# Altium project DDR5_Nucleo_Shield.PrjPcb
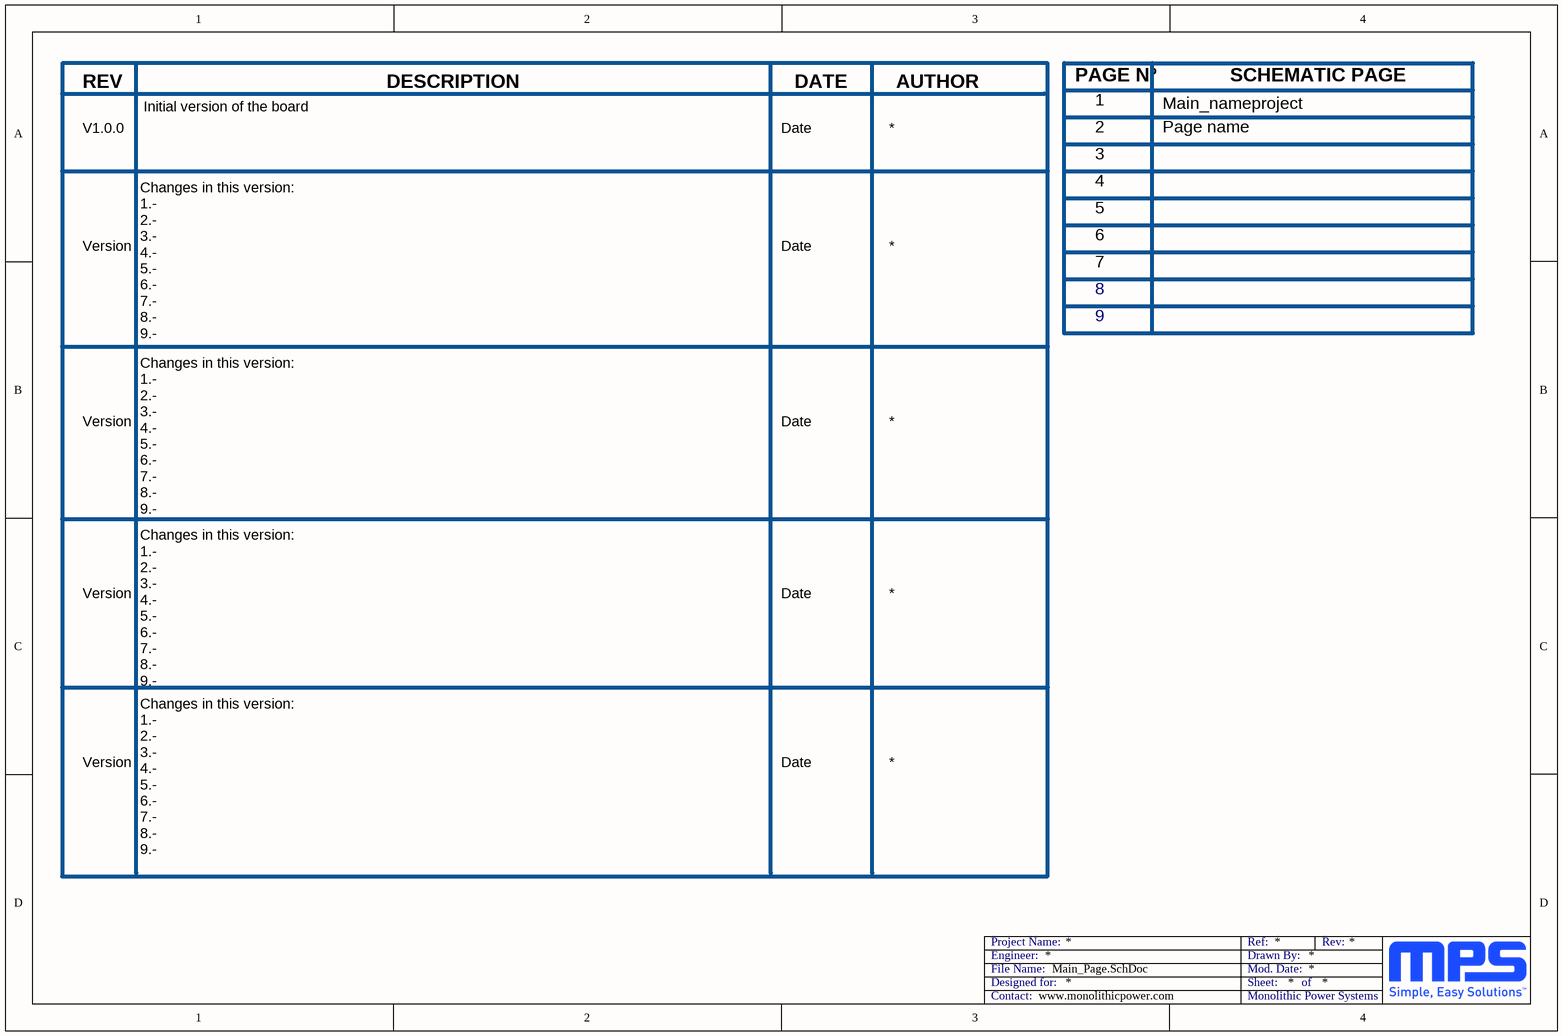
[diagram p0: Main_Page.SchDoc]
7 sheets, 129 parts. Net scope: global (net labels, ports and power ports of the same name join across sheets).
Board file: DDR5_Nucleo_Shield_PCB.PcbDoc
Sheets:
  Main_Page.SchDoc
  Power_Supply.SchDoc
  I3C_and_I2C_Slaves.SchDoc
  Peripherals.SchDoc
  Keyboard_Buttons.SchDoc
  Nucleo_Connector.SchDoc
  DDR5_System_Connector.SchDoc

## Sheet Main_Page.SchDoc
size A4; MPS_Contact: www.monolithicpower.com

### Notes on the sheet
- REV
- DESCRIPTION
- DATE
- AUTHOR
- PAGE Nº
- 1
- Main_nameproject
- SCHEMATIC PAGE
- V1.0.0
- Initial version of the board
- Date
- 2
- 3
- Page name
- 4
- 5
- 6
- Version
- 7
- 8
- Changes in this version:
  1.-
  2.-
  3.-
  4.-
  5.-
  6.-
  7.-
  8.-
  9.-
- 9
- Engineer:
- Designed for:
- File Name:
- Project Name:
- Mod. Date:
- Sheet:
- Drawn By:
- Ref:
- of
- Rev:
- Contact:
- Monolithic Power Systems

## Sheet Power_Supply.SchDoc
size A4; MPS_Contact: www.monolithicpower.com
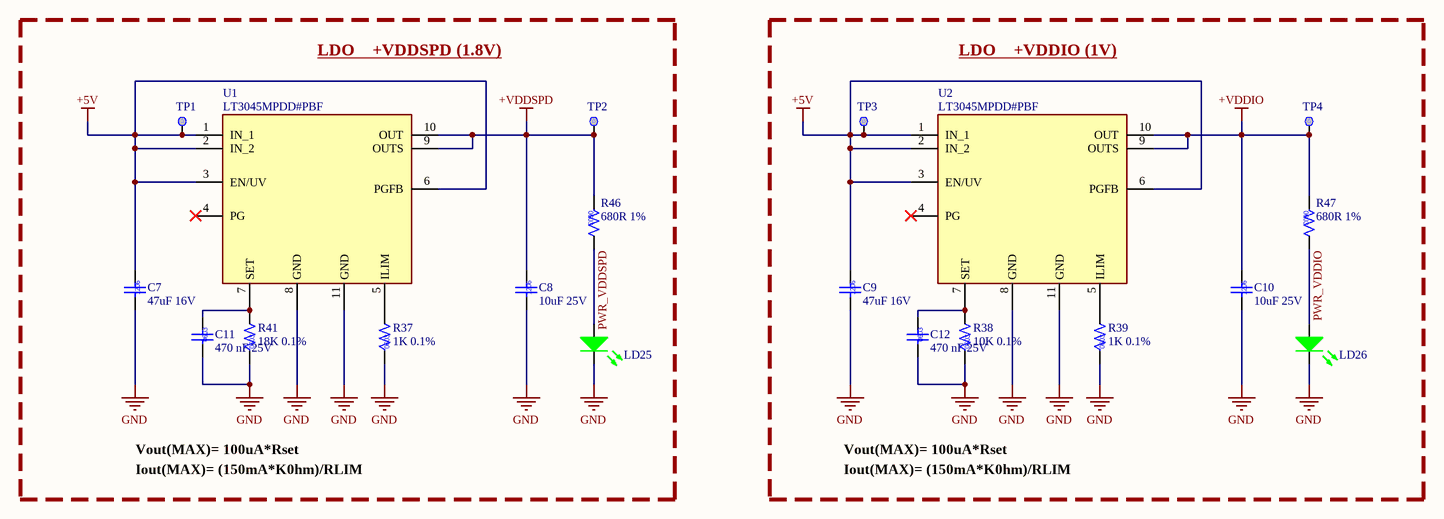
[diagram p1: Power_Supply.SchDoc]

### Parts
C7  47uF 16V  [CC/NM 1206]
C8  10uF 25V  [CC/NM 1206]
C9  47uF 16V  [CC/NM 1206]
C10  10uF 25V  [CC/NM 1206]
C11  470 nF 25V  [CC/NM 0603]
C12  470 nF 25V  [CC/NM 0603]
LD25  APHD1608LCGCK  [LED/0603/GREEN]  (value not drawn)
LD26  APHD1608LCGCK  [LED/0603/GREEN]  (value not drawn)
R37  1K 0.1%  [CC/NM 0603]
R38  10K 0.1%  [CC/NM 0603]
R39  1K 0.1%  [CC/NM 0603]
R41  18K 0.1%  [CC/NM 0603]
R46  680R 1%  [CC/NM 0603]
R47  680R 1%  [CC/NM 0603]
TP1  Test Point  [TP_SMD_1MM]  (value not drawn)  (no BOM)
TP2  Test Point  [TP_SMD_1MM]  (value not drawn)  (no BOM)
TP3  Test Point  [TP_SMD_1MM]  (value not drawn)  (no BOM)
TP4  Test Point  [TP_SMD_1MM]  (value not drawn)  (no BOM)
U1  LT3045MPDD#PBF  [SON50P300X300X80-11N]
U2  LT3045MPDD#PBF  [SON50P300X300X80-11N]

### Blocks framed on the sheet
LDO    +VDDSPD (1.8V): C7 C8 C11 LD25 R37 R41 R46 TP1 TP2 U1
LDO    +VDDIO (1V): C9 C10 C12 LD26 R38 R39 R47 TP3 TP4 U2

### Nets
+5V: C7.2 C9.2 TP1.1 TP3.1 U1.1(IN_1) U1.2(IN_2) U1.3(EN/UV) U1.6(PGFB) U2.1(IN_1) U2.2(IN_2) U2.3(EN/UV) U2.6(PGFB)
+VDDIO: C10.2 R47.1 TP4.1 U2.9(OUTS) U2.10(OUT)
+VDDSPD: C8.2 R46.1 TP2.1 U1.9(OUTS) U1.10(OUT)
GND: C7.1 C8.1 C9.1 C10.1 C11.1 C12.1 LD25.2(K) LD26.2(K) R37.1 R38.1 R39.1 R41.1 U1.8(GND) U1.11(GND) U2.8(GND) U2.11(GND)
PWR_VDDIO: LD26.1(A) R47.2
PWR_VDDSPD: LD25.1(A) R46.2
NetC11_2: C11.2 R41.2 U1.7(SET)
NetC12_2: C12.2 R38.2 U2.7(SET)
NetR37_2: R37.2 U1.5(ILIM)
NetR39_2: R39.2 U2.5(ILIM)

Not connected (* = marked no-connect by the designer): U1 4(PG)*; U2 4(PG)*

### Notes on the sheet
- Vout(MAX)= 100uA*Rset
- Iout(MAX)= (150mA*K0hm)/RLIM
- Engineer:
- Designed for:
- File Name:
- Project Name:
- Mod. Date:
- Sheet:
- Drawn By:
- Ref:
- of
- Rev:
- Contact:
- Monolithic Power Systems

### Library data of the parts
C7 C9 = 1206YD476MAT2A: Condensadores de cerámica multicapa (MLCC- SMD/SMT) KGM31HR51C476MU NEW GLOBAL PN 16V 47uF X A 581-KGM31HR51C476MU; Manufacturer: KYOCERA AVX; DrownBy: Xavier Rocher; Package: 1206; Supplier 1: Digikey; Supplier  Part Number 1: 4155127; Supplier 2: Mouser; Supplier  Part Number 2: 581-1206YD476MAT2A; Manufacturer Part Number: 1206YD476MAT2A; Automotive: https://datasheets.kyocera-avx.com/cx5r-KGM.pdf; Value: 47uF 16V
C8 C10 = CGA5L1X7R1E106K160AC: Condensadores de cerámica multicapa (MLCC- SMD/SMT) CGA 1206 25V 10uF X7R 10% AEC-Q200; Manufacturer: TDK; DrownBy: Xavier Rocher; Package: 1206; Supplier 1: Digikey; Supplier  Part Number 1: 2458327; Supplier 2: Mouser; Supplier  Part Number 2: 810-CGA5L1X7R1E106K; Manufacturer Part Number: CGA5L1X7R1E106K160AC; Automotive: https://www.farnell.com/datasheets/4520416.pdf?_gl=1*1qw350c*_gcl_aw*R0NMLjE3NzI0NTg0MDAuQ2p3S0NBaUFoNVhOQmhBQUVpd0FfQnU4RlFpaGh0aTJCR0F1SXBlQ2pXMWtFYmlZc2JraDRpajgydjZyT2lxVUUtZHBLLW80X0NoNy1Sb0NSZjhRQXZEX0J3RQ..*_gcl_au*MjEwMjY0Mzg0MC4xNzcyNDM5MTYx; Value: 10uF 25V
C11 C12 = C0603X6S0G474M030BC: Condensadores de cerámica multicapa (MLCC- SMD/SMT) 0201 4VDC 0.47uF 20% X6S 0.3mm; Manufacturer: TDK; DrownBy: Xavier Rocher; Datasheet: https://product.tdk.com/system/files/dam/doc/product/capacitor/ceramic/mlcc/catalog/mlcc_commercial_general_en.pdf; Package: 0603; Supplier 1: Digikey; Supplier  Part Number 1: 4171987; Supplier 2: Mouser; Supplier  Part Number 2: 810-C0603X6S0G474MBC; Manufacturer Part Number: C0603X6S0G474M030BC; Value: 470 nF 25V
LD25 LD26 = APHD1608LCGCK: Green Light Emitting Diode; Manufacturer: Kingbright; DrownBy: Xavier Rocher; Datasheet: https://www.kingbrightusa.com/images/catalog/SPEC/APHD1608LCGCK.pdf; Package: 0603; Supplier 1: Digikey; Supplier  Part Number 1: 754-2031-2-ND; Supplier 2: Mouser; Supplier  Part Number 2: 604-APHD1608LCGCK; Manufacturer Part Number: APHD1608LCGCK; Automotive: No; Value: APHD1608LCGCK
R37 R39 = TNPW06031K00BYCN: Resistores de película fina - SMD TNPW-0603 1K 0.1% T-13 R52; Manufacturer: Vishay; DrownBy: Xavier Rocher; Datasheet: https://4donline.ihs.com/images/VipMasterIC/IC/VISH/VISH-S-A0025054536/VISH-S-A0025054537-1.pdf?hkey=6D3A4C79FDBF58556ACFDE234799DDF0; Package: 0603; Supplier 1: Digikey; Supplier  Part Number 1: TNPW06031K00BYCN-ND; Supplier 2: Mouser; Supplier  Part Number 2: 71-TNPW060318K0BYCN; Manufacturer Part Number: TNPW06031K00BYCN; Automotive: Yes; Value: 1K 0.1%
R38 = CRT0603-BY-1002ELF: Thin Film Resistors - SMD 1/10watts 10K .1%; Manufacturer: Bourns; DrownBy: Xavier Rocher; Datasheet: https://4donline.ihs.com/images/VipMasterIC/IC/VISH/VISH-S-A0025054536/VISH-S-A0025054537-1.pdf?hkey=6D3A4C79FDBF58556ACFDE234799DDF0; Package: 0603; Supplier 1: Farnell; Supplier  Part Number 1: 2008310; Supplier 2: Mouser; Supplier  Part Number 2: 652-CRT0603BY1002ELF; Manufacturer Part Number: CRT0603-BY-1002ELF; Automotive: Yes; Value: 10K 0.1%
R41 = TNPW060318K0BYCN: Resistencia SMD de Tipo Chip, 20 kohm, ± 0.1%, 125 mW, 0603 [Métrica 1608], Película Delgada; Manufacturer: Vishay; DrownBy: Xavier Rocher; Datasheet: https://4donline.ihs.com/images/VipMasterIC/IC/VISH/VISH-S-A0025054536/VISH-S-A0025054537-1.pdf?hkey=6D3A4C79FDBF58556ACFDE234799DDF0; Package: 0603; Supplier 1: Farnell; Supplier  Part Number 1: 4140054; Supplier 2: Mouser; Supplier  Part Number 2: 71-TNPW060318K0BYCN; Manufacturer Part Number: TNPW060318K0BYCN; Automotive: Yes; Value: 18K 0.1%
R46 R47 = CR0603-FX-6800ELF: Resistores de película gruesa - SMD 680 ohm 1%; Manufacturer: BOURNS; DrownBy: Xavier Rocher; Datasheet: https://eu.mouser.com/datasheet/3/40/1/cr.pdf; Package: 0603; Supplier 1: Farnell; Supplier  Part Number 1: 4014380; Supplier 2: Mouser; Supplier  Part Number 2: 652-CR0603FX-6800ELF; Manufacturer Part Number: CR0603-FX-6800ELF; Automotive: No; Value: 680R 1%
TP1-TP4 = Test_Point_1mm: Test Point 1mm; Internal_Part_Number: MCD-00074; Part_Type: Mechanical; Status: Released; Manufacturer_Part_Number: n/a; Manufacturer: n/a; ComponentLink1Description: Datasheet; ComponentLink1URL: http://na; Provided_By: n/a; ECCN_US: n/a; ECCN_EU: n/a
U1 U2 = LT3045MPDD#PBF: 20V, 500mA, Ultralow Noise, Ultrahigh PSRR Linear Regulator; Manufacturer: Analog Devices; DrownBy: Xavier Rocher; Datasheet: https://www.analog.com/media/en/technical-documentation/data-sheets/lt3045.pdf; Package: DFN-10; Supplier 1: Farnell; Supplier  Part Number 1: 4027559; Supplier 2: Mouser; Supplier  Part Number 2: 584-LT3045MPDD#PBF; Manufacturer Part Number: LT3045MPDD#PBF; Automotive: Yes; Value: LT3045MPDD#PBF

## Sheet I3C_and_I2C_Slaves.SchDoc
size A4; MPS_Contact: www.monolithicpower.com
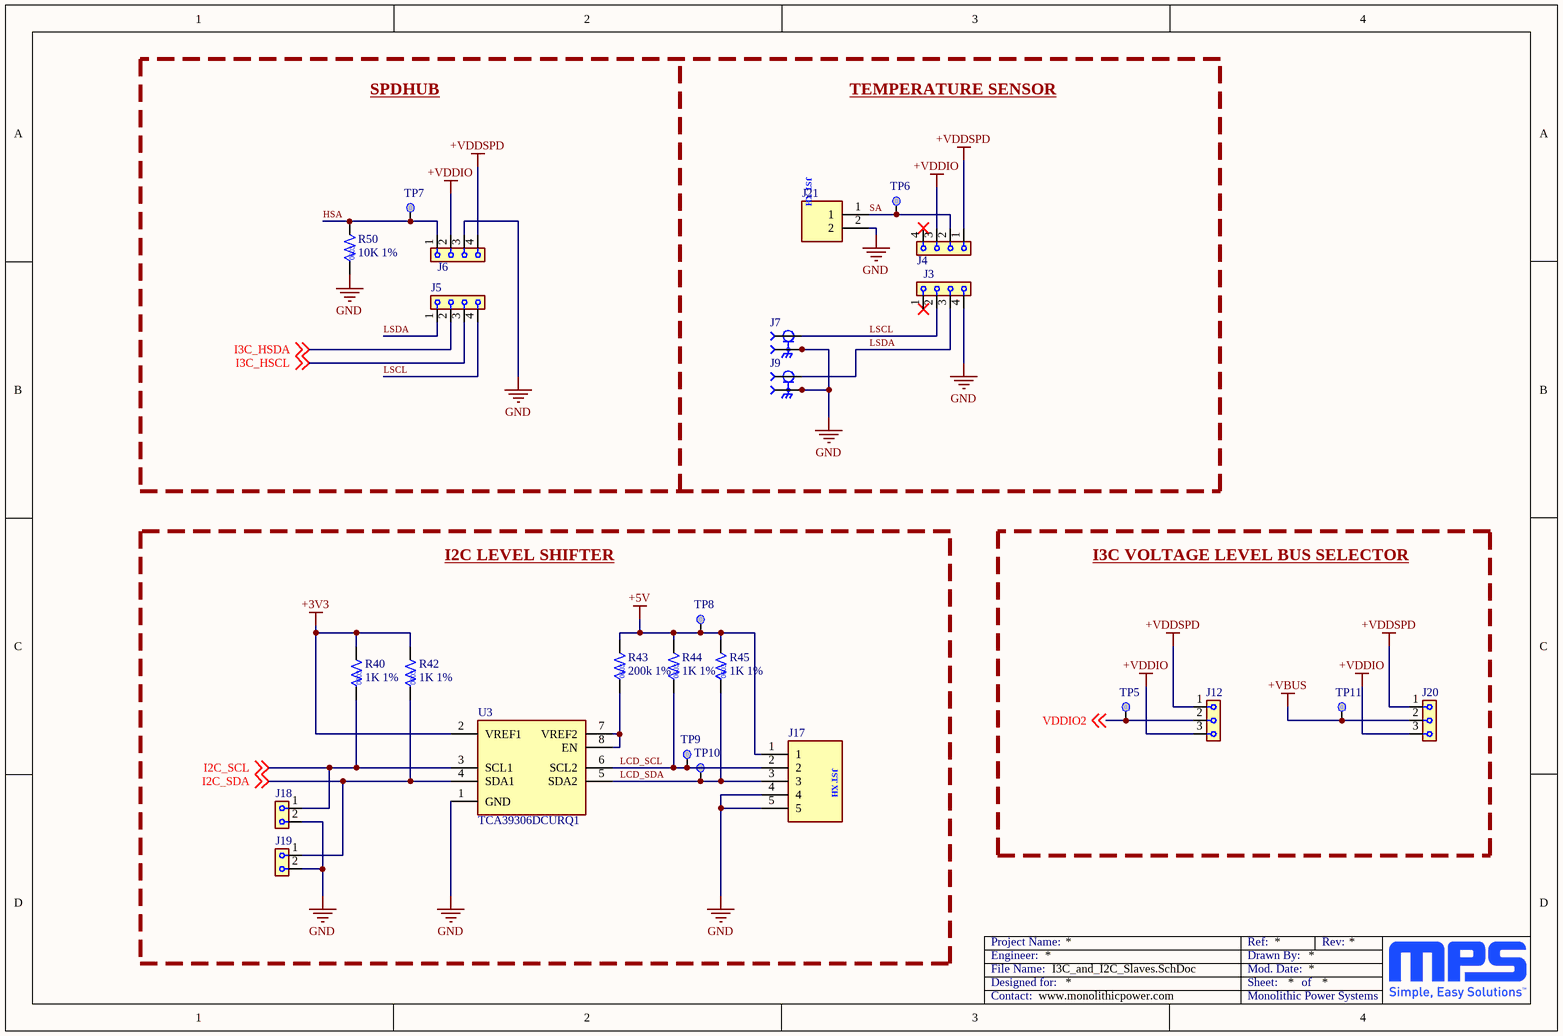
[diagram p2: I3C_and_I2C_Slaves.SchDoc]

### Parts
J3  61300411821  [61300411821]  (value not drawn)
J4  61300411821  [61300411821]  (value not drawn)
J5  61300411821  [61300411821]  (value not drawn)
J6  61300411821  [61300411821]  (value not drawn)
J7  MMCX-J-P-H-ST-TH1  [SAMTEC_MMCX-J-P-H-ST-TH1]  (value not drawn)
J9  MMCX-J-P-H-ST-TH1  [SAMTEC_MMCX-J-P-H-ST-TH1]  (value not drawn)
J12  TSW-103-07-F-S  [HEADER/VERT/1X3/M/P2.54]  (value not drawn)
J17  B5B-XH-A(LF)(SN)  [JST_XH_5V]  (value not drawn)
J18  TSW-102-07-F-S  [HEADER/VERT/1X2/M/P2.54]  (value not drawn)
J19  TSW-102-07-F-S  [HEADER/VERT/1X2/M/P2.54]  (value not drawn)
J20  TSW-103-07-F-S  [HEADER/VERT/1X3/M/P2.54]  (value not drawn)
J21  B2B-XH-A (LF)(SN)  [JST_XH_2V]  (value not drawn)
R40  1K 1%  [CC/NM 0603]
R42  1K 1%  [CC/NM 0603]
R43  200k 1%  [CC/NM 0603]
R44  1K 1%  [CC/NM 0603]
R45  1K 1%  [CC/NM 0603]
R50  10K 1%  [CC/NM 0603]
TP5  Test Point  [TP_SMD_1MM]  (value not drawn)  (no BOM)
TP6  Test Point  [TP_SMD_1MM]  (value not drawn)  (no BOM)
TP7  Test Point  [TP_SMD_1MM]  (value not drawn)  (no BOM)
TP8  Test Point  [TP_SMD_1MM]  (value not drawn)  (no BOM)
TP9  Test Point  [TP_SMD_1MM]  (value not drawn)  (no BOM)
TP10  Test Point  [TP_SMD_1MM]  (value not drawn)  (no BOM)
TP11  Test Point  [TP_SMD_1MM]  (value not drawn)  (no BOM)
U3  TCA39306DCURQ1  [SOP50P310X90-8N]

### Blocks framed on the sheet
I2C LEVEL SHIFTER: J17-J19 R40 R42-R45 TP8-TP10 U3
I3C VOLTAGE LEVEL BUS SELECTOR: J12 J20 TP5 TP11

### Nets
+3V3: R40.2 R42.2 U3.2(VREF1)
+5V: J17.1 R43.2 R44.2 R45.2 TP8.1
+VBUS: J20.2 TP11.1
+VDDIO: J4.3 J6.2 J12.3 J20.3
+VDDSPD: J4.1 J6.4 J12.1 J20.1
GND: J3.4 J6.3 J7.S1 J7.S2 J7.S3 J7.S4 J9.S1 J9.S2 J9.S3 J9.S4 J17.4 J17.5 J18.2 J19.2 J21.2 R50.1 U3.1(GND)
HSA: J6.1 R50.2 TP7.1
I2C_SCL: J18.1 R40.1 U3.3(SCL1) ; off-sheet I2C_SCL
I2C_SDA: J19.1 R42.1 U3.4(SDA1) ; off-sheet I2C_SDA
I3C_HSCL: J5.3 ; off-sheet I3C_HSCL
I3C_HSDA: J5.2 ; off-sheet I3C_HSDA
LCD_SCL: J17.2 R44.1 TP9.1 U3.6(SCL2)
LCD_SDA: J17.3 R45.1 TP10.1 U3.5(SDA2)
LSCL: J3.2 J5.4 J7.1
LSDA: J3.3 J5.1 J9.1
SA: J4.2 J21.1 TP6.1
VDDIO2: J12.2 TP5.1 ; off-sheet VDDIO2
NetR43_1: R43.1 U3.7(VREF2) U3.8(EN)

Not connected (* = marked no-connect by the designer): J3 1*; J4 4*

### Notes on the sheet
- SPDHUB
- TEMPERATURE SENSOR
- Engineer:
- Designed for:
- File Name:
- Project Name:
- Mod. Date:
- Sheet:
- Drawn By:
- Ref:
- of
- Rev:
- Contact:
- Monolithic Power Systems
- (in symbol B2B-XH-A (LF)(SN)) JST XH
- (in symbol B5B-XH-A(LF)(SN)) JST XH

### Library data of the parts
J3-J6 = 61300411821: 2.54mm Scket Header 4 pins; Manufacturer: Wurth Elektronik; DrownBy: Xavier Rocher; Datasheet: https://www.we-online.com/components/products/datasheet/61300411821.pdf; Package: 0603; Supplier 1: Digikey; Supplier  Part Number 1: 732-61300411821-ND; Supplier 2: Mouser; Supplier  Part Number 2: 710-61300411821; Manufacturer Part Number: 61300411821; Value: 61300411821
J7 J9 = MMCX-J-P-H-ST-TH1: RF Connectors / Coaxial Connectors 50 OHM MMCX JACK OR PLUG; Manufacturer: Samtec Inc.; DrownBy: Xavier Rocher; Datasheet: https://mm.digikey.com/Volume0/opasdata/d220001/medias/docus/6129/mmcx-j-p-x-st-th1-mkt.pdf; Package: 0603; Supplier 1: Digikey; Supplier  Part Number 1: SAM10617-ND; Supplier 2: Mouser; Supplier  Part Number 2: 200-MMCXJPHSTTH1; Manufacturer Part Number: MMCX-J-P-H-ST-TH1; Value: MMCX-J-P-H-ST-TH1
J12 J20 = TSW-103-07-F-S: Pin Header, Unshrouded, Board-to-Board, 2.54 mm, 1 Rows, 3 Contacts, Through Hole, TSW; Manufacturer: SAMTEC; DrownBy: Xavier Rocher; Datasheet: https://www.farnell.com/datasheets/1701645.pdf?_gl=1*1o3ly18*_gcl_aw*R0NMLjE3NzI0NTg0MDAuQ2p3S0NBaUFoNVhOQmhBQUVpd0FfQnU4RlFpaGh0aTJCR0F1SXBlQ2pXMWtFYmlZc2JraDRpajgydjZyT2lxVUUtZHBLLW80X0NoNy1Sb0NSZjhRQXZEX0J3RQ..*_gcl_au*MjEwMjY0Mzg0MC4xNzcyNDM5MTYx; Package: 0603; Supplier 1: Farnell; Supplier  Part Number 1: 2505043; Supplier 2: Mouser; Supplier  Part Number 2: 200-TSW10307FS; Manufacturer Part Number: TSW-103-07-F-S; Value: TSW-103-07-F-S
J17 = B5B-XH-A(LF)(SN): Alojamientos de cables y cabecera XH HEADER (TOP); Manufacturer: JST; DrownBy: Xavier Rocher; Package: XH; Supplier 1: Farnell; Supplier  Part Number 1: 1516281; Supplier 2: Mouser; Supplier  Part Number 2: 306-B5BXHALFSN; Manufacturer Part Number: B5B-XH-A(LF)(SN); Automotive: https://www.mouser.es/datasheet/3/1070/1/eXH.pdf; Value: B5B-XH-A(LF)(SN)
J18 J19 = TSW-102-07-F-S: Alojamientos de cables y cabecera 2.54MM CLASSIC PCB HDR STRIP; Manufacturer: SAMTEC; DrownBy: Xavier Rocher; Datasheet: https://www.farnell.com/datasheets/1701645.pdf?_gl=1*1o3ly18*_gcl_aw*R0NMLjE3NzI0NTg0MDAuQ2p3S0NBaUFoNVhOQmhBQUVpd0FfQnU4RlFpaGh0aTJCR0F1SXBlQ2pXMWtFYmlZc2JraDRpajgydjZyT2lxVUUtZHBLLW80X0NoNy1Sb0NSZjhRQXZEX0J3RQ..*_gcl_au*MjEwMjY0Mzg0MC4xNzcyNDM5MTYx; Package: 0603; Supplier 1: Farnell; Supplier  Part Number 1: 2779661; Supplier 2: Mouser; Supplier  Part Number 2: 200-TSW10207FS; Manufacturer Part Number: TSW-102-07-F-S; Value: TSW-102-07-F-S
J21 = B2B-XH-A (LF)(SN): Alojamientos de cables y cabecera 2.54MM CLASSIC PCB HDR STRIP; Manufacturer: JST; DrownBy: Xavier Rocher; Datasheet: https://www.farnell.com/datasheets/2057209.pdf?_gl=1*1fl0mut*_gcl_aw*R0NMLjE3NzI0NTg0MDAuQ2p3S0NBaUFoNVhOQmhBQUVpd0FfQnU4RlFpaGh0aTJCR0F1SXBlQ2pXMWtFYmlZc2JraDRpajgydjZyT2lxVUUtZHBLLW80X0NoNy1Sb0NSZjhRQXZEX0J3RQ..*_gcl_au*MjEwMjY0Mzg0MC4xNzcyNDM5MTYx; Package: XH; Supplier 1: Farnell; Supplier  Part Number 1: 1516276; Supplier 2: Mouser; Supplier  Part Number 2: 306-B2BXHALFSNP; Manufacturer Part Number: B2B-XH-A (LF)(SN); Value: B2B-XH-A (LF)(SN)
R40 R42 R44 R45 = RT0603BRD101KL: Manufacturer: YAGEO; DrownBy: Xavier Rocher; Package: 0603; Supplier 1: Farnell; Supplier  Part Number 1: 3496584; Supplier 2: Mouser; Supplier  Part Number 2: 603-RT0603BRD101KL; Manufacturer Part Number: RT0603BRD101KL; Value: 1K 1%
R43 = CRCW0603200KFHEAP: Resistores de película gruesa - SMD D11/CRCW0603-P 50 200K 1% ET1 e3; DrownBy: Xavier Rocher; Package: 0603; Supplier 1: Digikey; Supplier  Part Number 1: CRCW0603200KFHEAP-ND; Supplier 2: Mouser; Supplier  Part Number 2: 71-CRCW0603200KFHEAP; Manufacturer Part Number: CRCW0603200KFHEAP; Value: 200k 1%
R50 = AC0603FR-0710KL: Manufacturer: YAGEO; DrownBy: Xavier Rocher; Package: 0603; Supplier 1: Farnell; Supplier  Part Number 1: 2363472; Supplier 2: Mouser; Supplier  Part Number 2: 603-AC0603FR-0710KL; Manufacturer Part Number: AC0603FR-0710KL; Value: 10K 1%
TP5-TP11 = Test_Point_1mm: as TP1 on sheet Power_Supply; Status: Released; Manufacturer_Part_Number: n/a; Manufacturer: n/a; ComponentLink1Description: Datasheet; ComponentLink1URL: http://na; Provided_By: n/a; ECCN_US: n/a; ECCN_EU: n/a
U3 = TCA39306DCURQ1: Manufacturer: TI; DrownBy: Xavier Rocher; Datasheet: https://www.ti.com/lit/ds/symlink/tca39306-q1.pdf?ts=1772335428960; Package: VSSOP-8; Supplier 1: Digikey; Supplier  Part Number 1: 296-TCA39306DCURQ1TR-ND; Supplier 2: Mouser; Supplier  Part Number 2: 595-TCA39306DCURQ1; Manufacturer Part Number: TCA39306DCURQ1; Automotive: Yes; Value: TCA39306DCURQ1

## Sheet Peripherals.SchDoc
size A4; MPS_Contact: www.monolithicpower.com
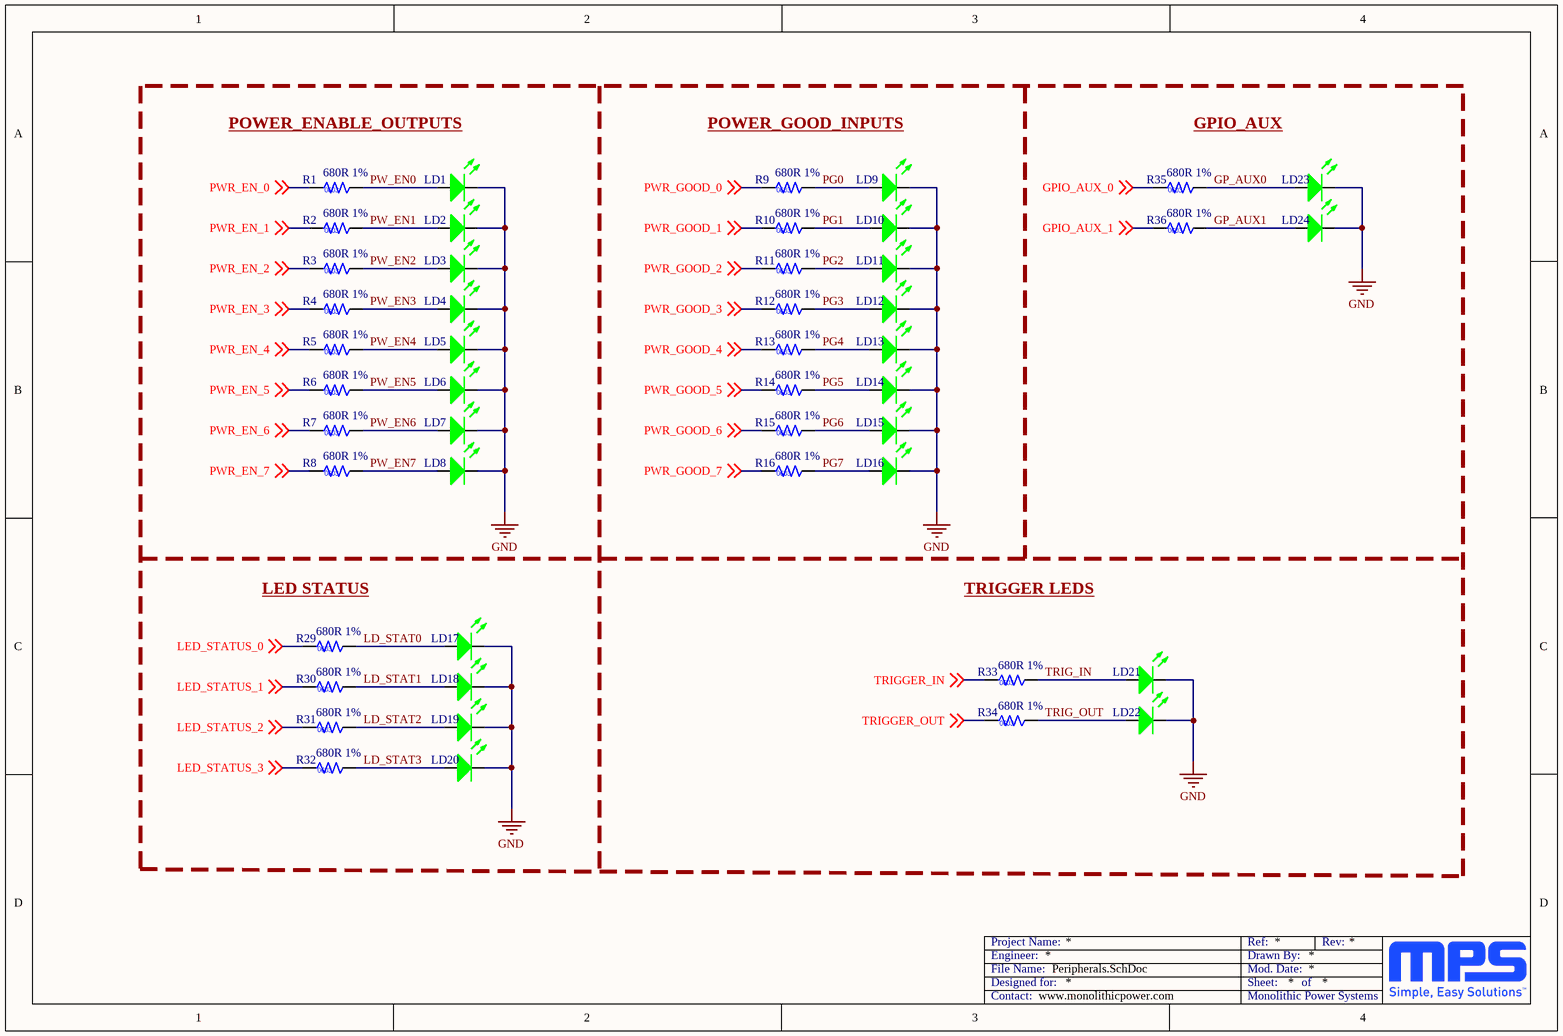
[diagram p3: Peripherals.SchDoc]

### Parts
LD1  APHD1608LCGCK  [LED/0603/GREEN]  (value not drawn)
LD2  APHD1608LCGCK  [LED/0603/GREEN]  (value not drawn)
LD3  APHD1608LCGCK  [LED/0603/GREEN]  (value not drawn)
LD4  APHD1608LCGCK  [LED/0603/GREEN]  (value not drawn)
LD5  APHD1608LCGCK  [LED/0603/GREEN]  (value not drawn)
LD6  APHD1608LCGCK  [LED/0603/GREEN]  (value not drawn)
LD7  APHD1608LCGCK  [LED/0603/GREEN]  (value not drawn)
LD8  APHD1608LCGCK  [LED/0603/GREEN]  (value not drawn)
LD9  APHD1608LCGCK  [LED/0603/GREEN]  (value not drawn)
LD10  APHD1608LCGCK  [LED/0603/GREEN]  (value not drawn)
LD11  APHD1608LCGCK  [LED/0603/GREEN]  (value not drawn)
LD12  APHD1608LCGCK  [LED/0603/GREEN]  (value not drawn)
LD13  APHD1608LCGCK  [LED/0603/GREEN]  (value not drawn)
LD14  APHD1608LCGCK  [LED/0603/GREEN]  (value not drawn)
LD15  APHD1608LCGCK  [LED/0603/GREEN]  (value not drawn)
LD16  APHD1608LCGCK  [LED/0603/GREEN]  (value not drawn)
LD17  APHD1608LCGCK  [LED/0603/GREEN]  (value not drawn)
LD18  APHD1608LCGCK  [LED/0603/GREEN]  (value not drawn)
LD19  APHD1608LCGCK  [LED/0603/GREEN]  (value not drawn)
LD20  APHD1608LCGCK  [LED/0603/GREEN]  (value not drawn)
LD21  APHD1608LCGCK  [LED/0603/GREEN]  (value not drawn)
LD22  APHD1608LCGCK  [LED/0603/GREEN]  (value not drawn)
LD23  APHD1608LCGCK  [LED/0603/GREEN]  (value not drawn)
LD24  APHD1608LCGCK  [LED/0603/GREEN]  (value not drawn)
R1  680R 1%  [CC/NM 0603]
R2  680R 1%  [CC/NM 0603]
R3  680R 1%  [CC/NM 0603]
R4  680R 1%  [CC/NM 0603]
R5  680R 1%  [CC/NM 0603]
R6  680R 1%  [CC/NM 0603]
R7  680R 1%  [CC/NM 0603]
R8  680R 1%  [CC/NM 0603]
R9  680R 1%  [CC/NM 0603]
R10  680R 1%  [CC/NM 0603]
R11  680R 1%  [CC/NM 0603]
R12  680R 1%  [CC/NM 0603]
R13  680R 1%  [CC/NM 0603]
R14  680R 1%  [CC/NM 0603]
R15  680R 1%  [CC/NM 0603]
R16  680R 1%  [CC/NM 0603]
R29  680R 1%  [CC/NM 0603]
R30  680R 1%  [CC/NM 0603]
R31  680R 1%  [CC/NM 0603]
R32  680R 1%  [CC/NM 0603]
R33  680R 1%  [CC/NM 0603]
R34  680R 1%  [CC/NM 0603]
R35  680R 1%  [CC/NM 0603]
R36  680R 1%  [CC/NM 0603]

### Nets
GND: LD1.2(K) LD2.2(K) LD3.2(K) LD4.2(K) LD5.2(K) LD6.2(K) LD7.2(K) LD8.2(K) LD9.2(K) LD10.2(K) LD11.2(K) LD12.2(K) LD13.2(K) LD14.2(K) LD15.2(K) LD16.2(K) LD17.2(K) LD18.2(K) LD19.2(K) LD20.2(K) LD21.2(K) LD22.2(K) LD23.2(K) LD24.2(K)
GP_AUX0: LD23.1(A) R35.2
GP_AUX1: LD24.1(A) R36.2
GPIO_AUX_0: R35.1 ; off-sheet GPIO_AUX_0
GPIO_AUX_1: R36.1 ; off-sheet GPIO_AUX_1
LD_STAT0: LD17.1(A) R29.2
LD_STAT1: LD18.1(A) R30.2
LD_STAT2: LD19.1(A) R31.2
LD_STAT3: LD20.1(A) R32.2
LED_STATUS_0: R29.1 ; off-sheet LED_STATUS_0
LED_STATUS_1: R30.1 ; off-sheet LED_STATUS_1
LED_STATUS_2: R31.1 ; off-sheet LED_STATUS_2
LED_STATUS_3: R32.1 ; off-sheet LED_STATUS_3
PG0: LD9.1(A) R9.2
PG1: LD10.1(A) R10.2
PG2: LD11.1(A) R11.2
PG3: LD12.1(A) R12.2
PG4: LD13.1(A) R13.2
PG5: LD14.1(A) R14.2
PG6: LD15.1(A) R15.2
PG7: LD16.1(A) R16.2
PW_EN0: LD1.1(A) R1.2
PW_EN1: LD2.1(A) R2.2
PW_EN2: LD3.1(A) R3.2
PW_EN3: LD4.1(A) R4.2
PW_EN4: LD5.1(A) R5.2
PW_EN5: LD6.1(A) R6.2
PW_EN6: LD7.1(A) R7.2
PW_EN7: LD8.1(A) R8.2
PWR_EN_0: R1.1 ; off-sheet PWR_EN_0
PWR_EN_1: R2.1 ; off-sheet PWR_EN_1
PWR_EN_2: R3.1 ; off-sheet PWR_EN_2
PWR_EN_3: R4.1 ; off-sheet PWR_EN_3
PWR_EN_4: R5.1 ; off-sheet PWR_EN_4
PWR_EN_5: R6.1 ; off-sheet PWR_EN_5
PWR_EN_6: R7.1 ; off-sheet PWR_EN_6
PWR_EN_7: R8.1 ; off-sheet PWR_EN_7
PWR_GOOD_0: R9.1 ; off-sheet PWR_GOOD_0
PWR_GOOD_1: R10.1 ; off-sheet PWR_GOOD_1
PWR_GOOD_2: R11.1 ; off-sheet PWR_GOOD_2
PWR_GOOD_3: R12.1 ; off-sheet PWR_GOOD_3
PWR_GOOD_4: R13.1 ; off-sheet PWR_GOOD_4
PWR_GOOD_5: R14.1 ; off-sheet PWR_GOOD_5
PWR_GOOD_6: R15.1 ; off-sheet PWR_GOOD_6
PWR_GOOD_7: R16.1 ; off-sheet PWR_GOOD_7
TRIG_IN: LD21.1(A) R33.2
TRIG_OUT: LD22.1(A) R34.2
TRIGGER_IN: R33.1 ; off-sheet TRIGGER_IN
TRIGGER_OUT: R34.1 ; off-sheet TRIGGER_OUT

### Notes on the sheet
- POWER_ENABLE_OUTPUTS
- POWER_GOOD_INPUTS
- GPIO_AUX
- (near R29) LED STATUS
- TRIGGER LEDS
- Engineer:
- Designed for:
- File Name:
- Project Name:
- Mod. Date:
- Sheet:
- Drawn By:
- Ref:
- of
- Rev:
- Contact:
- Monolithic Power Systems

### Library data of the parts
LD1-LD24 = APHD1608LCGCK: as LD25 on sheet Power_Supply; Datasheet: https://www.kingbrightusa.com/images/catalog/SPEC/APHD1608LCGCK.pdf; Package: 0603; Supplier 1: Digikey; Supplier  Part Number 1: 754-2031-2-ND; Supplier 2: Mouser; Supplier  Part Number 2: 604-APHD1608LCGCK; Manufacturer Part Number: APHD1608LCGCK; Automotive: No; Value: APHD1608LCGCK
R1-R16 R29-R36 = CR0603-FX-6800ELF: as R46 on sheet Power_Supply; Datasheet: https://eu.mouser.com/datasheet/3/40/1/cr.pdf; Package: 0603; Supplier 1: Farnell; Supplier  Part Number 1: 4014380; Supplier 2: Mouser; Supplier  Part Number 2: 652-CR0603FX-6800ELF; Manufacturer Part Number: CR0603-FX-6800ELF; Automotive: No; Value: 680R 1%

## Sheet Keyboard_Buttons.SchDoc
size A4; MPS_Contact: www.monolithicpower.com
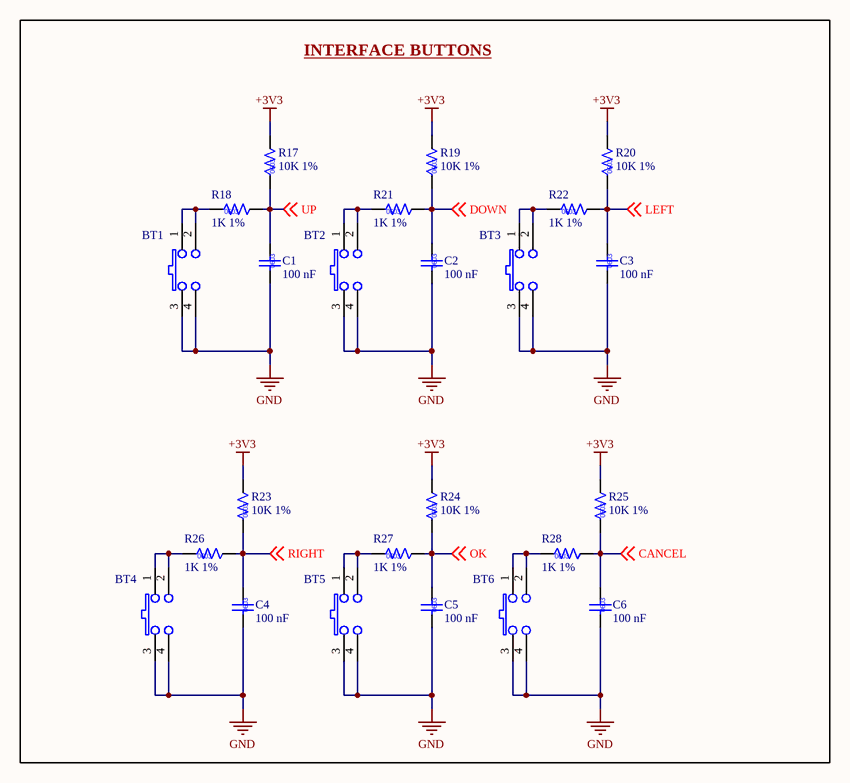
[diagram p4: Keyboard_Buttons.SchDoc]

### Parts
BT1  TS14-1212-60-BK-260-SCR-D  [TS14121260BK260SCRD]  (value not drawn)
BT2  TS14-1212-60-BK-260-SCR-D  [TS14121260BK260SCRD]  (value not drawn)
BT3  TS14-1212-60-BK-260-SCR-D  [TS14121260BK260SCRD]  (value not drawn)
BT4  TS14-1212-60-BK-260-SCR-D  [TS14121260BK260SCRD]  (value not drawn)
BT5  TS14-1212-60-BK-260-SCR-D  [TS14121260BK260SCRD]  (value not drawn)
BT6  TS14-1212-60-BK-260-SCR-D  [TS14121260BK260SCRD]  (value not drawn)
C1  100 nF  [CC/NM 0603]
C2  100 nF  [CC/NM 0603]
C3  100 nF  [CC/NM 0603]
C4  100 nF  [CC/NM 0603]
C5  100 nF  [CC/NM 0603]
C6  100 nF  [CC/NM 0603]
R17  10K 1%  [CC/NM 0603]
R18  1K 1%  [CC/NM 0603]
R19  10K 1%  [CC/NM 0603]
R20  10K 1%  [CC/NM 0603]
R21  1K 1%  [CC/NM 0603]
R22  1K 1%  [CC/NM 0603]
R23  10K 1%  [CC/NM 0603]
R24  10K 1%  [CC/NM 0603]
R25  10K 1%  [CC/NM 0603]
R26  1K 1%  [CC/NM 0603]
R27  1K 1%  [CC/NM 0603]
R28  1K 1%  [CC/NM 0603]

### Blocks framed on the sheet
INTERFACE BUTTONS: BT1-BT6 C1-C6 R17-R28

### Nets
+3V3: R17.2 R19.2 R20.2 R23.2 R24.2 R25.2
GND: BT1.3 BT1.4 BT2.3 BT2.4 BT3.3 BT3.4 BT4.3 BT4.4 BT5.3 BT5.4 BT6.3 BT6.4 C1.1 C2.1 C3.1 C4.1 C5.1 C6.1
CANCEL: C6.2 R25.1 R28.2 ; off-sheet CANCEL
DOWN: C2.2 R19.1 R21.2 ; off-sheet DOWN
LEFT: C3.2 R20.1 R22.2 ; off-sheet LEFT
OK: C5.2 R24.1 R27.2 ; off-sheet OK
RIGHT: C4.2 R23.1 R26.2 ; off-sheet RIGHT
UP: C1.2 R17.1 R18.2 ; off-sheet UP
NetBT1_1: BT1.1 BT1.2 R18.1
NetBT2_1: BT2.1 BT2.2 R21.1
NetBT3_1: BT3.1 BT3.2 R22.1
NetBT4_1: BT4.1 BT4.2 R26.1
NetBT5_1: BT5.1 BT5.2 R27.1
NetBT6_1: BT6.1 BT6.2 R28.1

### Notes on the sheet
- Engineer:
- Designed for:
- File Name:
- Project Name:
- Mod. Date:
- Sheet:
- Drawn By:
- Ref:
- of
- Rev:
- Contact:
- Monolithic Power Systems

### Library data of the parts
BT1-BT6 = TS14-1212-60-BK-260-SCR-D: Interruptores táctiles 12 x 12 mm 6 mm 260 gf Short Crimped Black Through Hole SPST; Manufacturer: Same Sky; DrownBy: Xavier Rocher; Datasheet: https://www.mouser.es/datasheet/3/6118/1/ts14.pdf; Package: Through Hole; Supplier 1: Digikey; Supplier  Part Number 1: 2223-TS14-1212-60-BK-260-SCR-D-ND; Supplier 2: Mouser; Supplier  Part Number 2: 179-TS14121260260SCR; Manufacturer Part Number: TS14-1212-60-BK-260-SCR-D; Value: TS14-1212-60-BK-260-SCR-D
C1-C6 = KGM15AV51E104ZM: / 0.1 µF -20%, +80% 25V Ceramic Capacitor Y5V (F) 0603 (1608 Metric); Manufacturer: KYOCERA AVX; DrownBy: Xavier Rocher; Datasheet: https://datasheets.kyocera-avx.com/KGM_Y5V.pdf; Package: 0603; Supplier 1: Digikey; Supplier  Part Number 1: 581-KGM15AV51E104ZM; Supplier 2: Mouser; Supplier  Part Number 2: 478-KGM15AV51E104ZMTR-ND; Manufacturer Part Number: KGM15AV51E104ZM; Value: 100 nF
R17 R19 R20 R23-R25 = AC0603FR-0710KL: as R50 on sheet I3C_and_I2C_Slaves; Package: 0603; Supplier 1: Farnell; Supplier  Part Number 1: 2363472; Supplier 2: Mouser; Supplier  Part Number 2: 603-AC0603FR-0710KL; Manufacturer Part Number: AC0603FR-0710KL; Value: 10K 1%
R18 R21 R22 R26-R28 = RT0603BRD101KL: as R40 on sheet I3C_and_I2C_Slaves; Package: 0603; Supplier 1: Farnell; Supplier  Part Number 1: 3496584; Supplier 2: Mouser; Supplier  Part Number 2: 603-RT0603BRD101KL; Manufacturer Part Number: RT0603BRD101KL; Value: 1K 1%

## Sheet Nucleo_Connector.SchDoc
size A4; MPS_Contact: www.monolithicpower.com
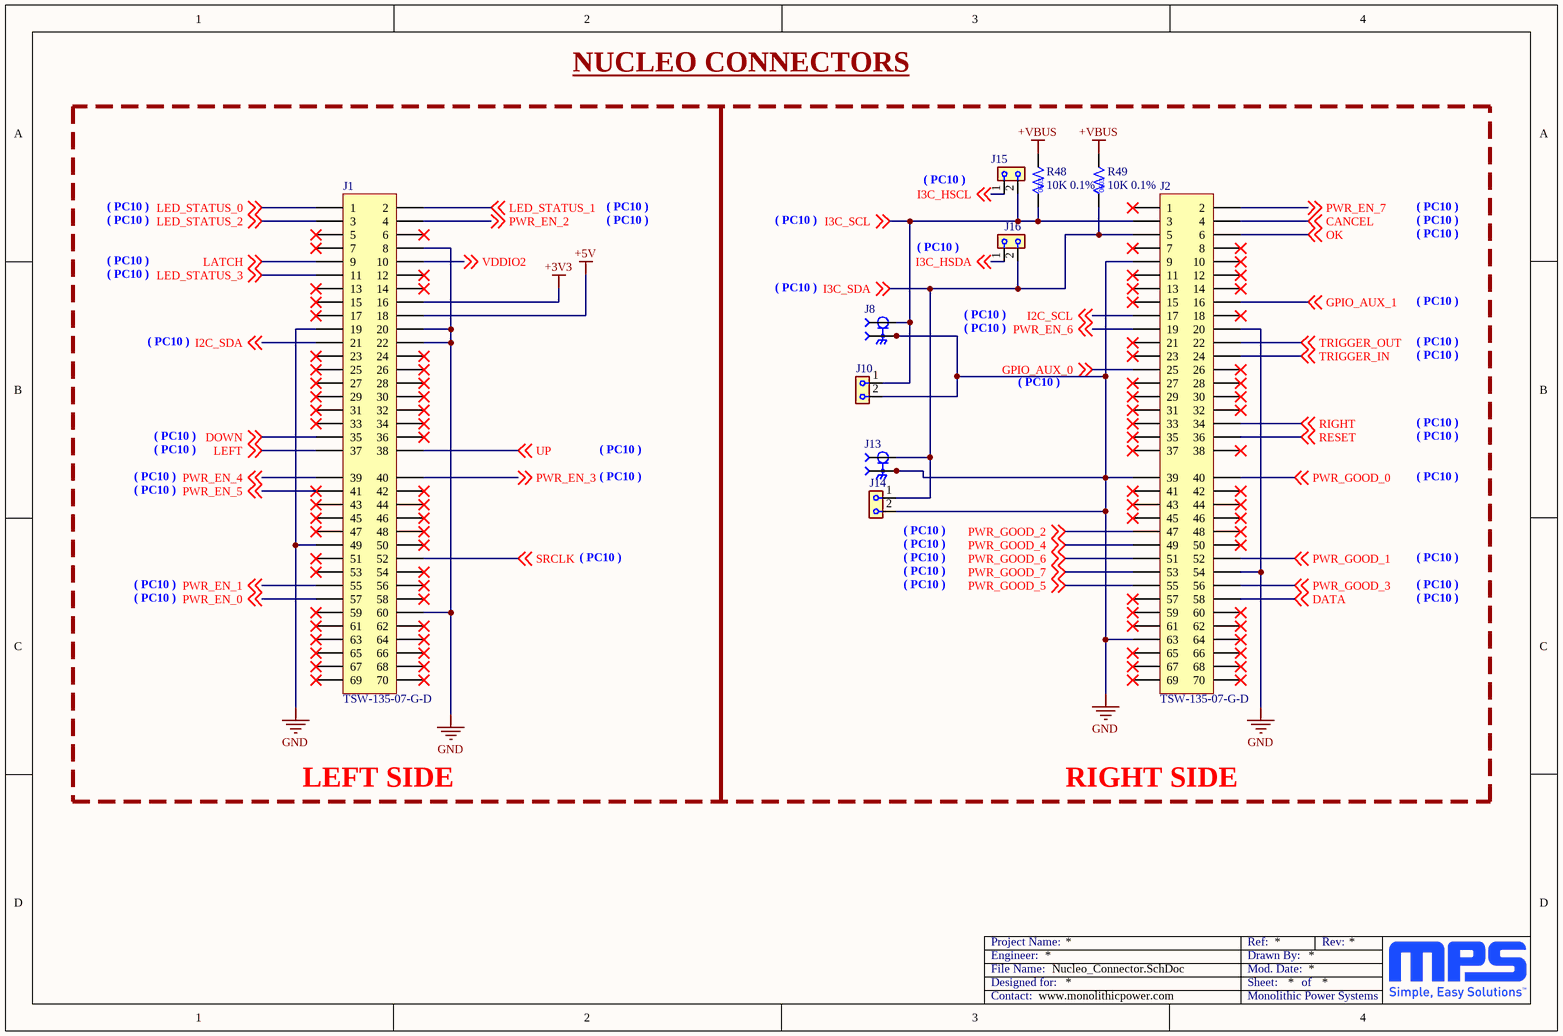
[diagram p5: Nucleo_Connector.SchDoc]

### Parts
J1  TSW-135-07-G-D  [CON_SAMTEC_TSW-135-07-X-D]
J2  TSW-135-07-G-D  [CON_SAMTEC_TSW-135-07-X-D]
J8  MMCX-J-P-H-ST-TH1  [SAMTEC_MMCX-J-P-H-ST-TH1]  (value not drawn)
J10  TSW-102-07-F-S  [HEADER/VERT/1X2/M/P2.54]  (value not drawn)
J13  MMCX-J-P-H-ST-TH1  [SAMTEC_MMCX-J-P-H-ST-TH1]  (value not drawn)
J14  TSW-102-07-F-S  [HEADER/VERT/1X2/M/P2.54]  (value not drawn)
J15  TSW-102-07-F-S  [HEADER/VERT/1X2/M/P2.54]  (value not drawn)
J16  TSW-102-07-F-S  [HEADER/VERT/1X2/M/P2.54]  (value not drawn)
R48  10K 0.1%  [CC/NM 0603]
R49  10K 0.1%  [CC/NM 0603]

### Nets
+3V3: J1.16
+5V: J1.18
+VBUS: R48.2 R49.2
GND: J1.8 J1.19 J1.20 J1.22 J1.49 J1.60 J2.9 J2.20 J2.39 J2.54 J2.63 J8.S1 J8.S2 J8.S3 J8.S4 J10.2 J13.S1 J13.S2 J13.S3 J13.S4 J14.2
CANCEL: J2.4 ; off-sheet CANCEL
DATA: J2.58 ; off-sheet DATA
DOWN: J1.35 ; off-sheet DOWN
GPIO_AUX_0: J2.25 ; off-sheet GPIO_AUX_0
GPIO_AUX_1: J2.16 ; off-sheet GPIO_AUX_1
I2C_SCL: J2.17 ; off-sheet I2C_SCL
I2C_SDA: J1.21 ; off-sheet I2C_SDA
I3C_HSCL: J15.1 ; off-sheet I3C_HSCL
I3C_HSDA: J16.1 ; off-sheet I3C_HSDA
I3C_SCL: J2.3 J8.1 J10.1 J15.2 R48.1 ; off-sheet I3C_SCL
I3C_SDA: J2.5 J13.1 J14.1 J16.2 R49.1 ; off-sheet I3C_SDA
LATCH: J1.9 ; off-sheet LATCH
LED_STATUS_0: J1.1 ; off-sheet LED_STATUS_0
LED_STATUS_1: J1.2 ; off-sheet LED_STATUS_1
LED_STATUS_2: J1.3 ; off-sheet LED_STATUS_2
LED_STATUS_3: J1.11 ; off-sheet LED_STATUS_3
LEFT: J1.37 ; off-sheet LEFT
OK: J2.6 ; off-sheet OK
PWR_EN_0: J1.57 ; off-sheet PWR_EN_0
PWR_EN_1: J1.55 ; off-sheet PWR_EN_1
PWR_EN_2: J1.4 ; off-sheet PWR_EN_2
PWR_EN_3: J1.40 ; off-sheet PWR_EN_3
PWR_EN_4: J1.39 ; off-sheet PWR_EN_4
PWR_EN_5: J1.41 ; off-sheet PWR_EN_5
PWR_EN_6: J2.19 ; off-sheet PWR_EN_6
PWR_EN_7: J2.2 ; off-sheet PWR_EN_7
PWR_GOOD_0: J2.40 ; off-sheet PWR_GOOD_0
PWR_GOOD_1: J2.52 ; off-sheet PWR_GOOD_1
PWR_GOOD_2: J2.47 ; off-sheet PWR_GOOD_2
PWR_GOOD_3: J2.56 ; off-sheet PWR_GOOD_3
PWR_GOOD_4: J2.49 ; off-sheet PWR_GOOD_4
PWR_GOOD_5: J2.55 ; off-sheet PWR_GOOD_5
PWR_GOOD_6: J2.51 ; off-sheet PWR_GOOD_6
PWR_GOOD_7: J2.53 ; off-sheet PWR_GOOD_7
RESET: J2.36 ; off-sheet RESET
RIGHT: J2.34 ; off-sheet RIGHT
SRCLK: J1.52 ; off-sheet SRCLK
TRIGGER_IN: J2.24 ; off-sheet TRIGGER_IN
TRIGGER_OUT: J2.22 ; off-sheet TRIGGER_OUT
UP: J1.38 ; off-sheet UP
VDDIO2: J1.10 ; off-sheet VDDIO2

Not connected (* = marked no-connect by the designer): J1 5* 6* 7* 12* 13* 14* 15* 17* 23* 24* 25* 26* 27* 28* 29* 30* 31* 32* 33* 34* 36* 42* 43* 44* 45* 46* 47* 48* 50* 51* 53* 54* 56* 58* 59* 61* 62* 63* 64* 65* 66* 67* 68* 69* 70*; J2 1* 7* 8* 10* 11* 12* 13* 14* 15* 18* 21* 23* 26* 27* 28* 29* 30* 31* 32* 33* 35* 37* 38* 41* 42* 43* 44* 45* 46* 48* 50* 57* 59* 60* 61* 62* 64* 65* 66* 67* 68* 69* 70*

### Notes on the sheet
- NUCLEO CONNECTORS
- ( PC10 )
- (near J16) ( PC10 )
- (near J15) ( PC10 )
- (near J8) ( PC10 )
- (near J14) ( PC10 )
- LEFT SIDE
- RIGHT SIDE
- Engineer:
- Designed for:
- File Name:
- Project Name:
- Mod. Date:
- Sheet:
- Drawn By:
- Ref:
- of
- Rev:
- Contact:
- Monolithic Power Systems

### Library data of the parts
J1 J2 = TSW-135-07-G-D: Header, 35x2, 2,54mm, VR, TH, Height 5.84mm/2.54mm; Manufacturer: Samtec; DrownBy: Xavier Rocher; Package: 0603; Supplier 1: Farnell; Supplier  Part Number 1: 3664498; Supplier 2: Mouser; Supplier  Part Number 2: 200-TSW13507GD; Manufacturer Part Number: TSW-135-07-G-D; Value: TSW-135-07-G-D
J8 J13 = MMCX-J-P-H-ST-TH1: as J7 on sheet I3C_and_I2C_Slaves; Datasheet: https://mm.digikey.com/Volume0/opasdata/d220001/medias/docus/6129/mmcx-j-p-x-st-th1-mkt.pdf; Package: 0603; Supplier 1: Digikey; Supplier  Part Number 1: SAM10617-ND; Supplier 2: Mouser; Supplier  Part Number 2: 200-MMCXJPHSTTH1; Manufacturer Part Number: MMCX-J-P-H-ST-TH1; Value: MMCX-J-P-H-ST-TH1
J10 J14-J16 = TSW-102-07-F-S: as J18 on sheet I3C_and_I2C_Slaves; Datasheet: https://www.farnell.com/datasheets/1701645.pdf?_gl=1*1o3ly18*_gcl_aw*R0NMLjE3NzI0NTg0MDAuQ2p3S0NBaUFoNVhOQmhBQUVpd0FfQnU4RlFpaGh0aTJCR0F1SXBlQ2pXMWtFYmlZc2JraDRpajgydjZyT2lxVUUtZHBLLW80X0NoNy1Sb0NSZjhRQXZEX0J3RQ..*_gcl_au*MjEwMjY0Mzg0MC4xNzcyNDM5MTYx; Package: 0603; Supplier 1: Farnell; Supplier  Part Number 1: 2779661; Supplier 2: Mouser; Supplier  Part Number 2: 200-TSW10207FS; Manufacturer Part Number: TSW-102-07-F-S; Value: TSW-102-07-F-S
R48 R49 = CRT0603-BY-1002ELF: as R38 on sheet Power_Supply; Datasheet: https://4donline.ihs.com/images/VipMasterIC/IC/VISH/VISH-S-A0025054536/VISH-S-A0025054537-1.pdf?hkey=6D3A4C79FDBF58556ACFDE234799DDF0; Package: 0603; Supplier 1: Farnell; Supplier  Part Number 1: 2008310; Supplier 2: Mouser; Supplier  Part Number 2: 652-CRT0603BY1002ELF; Manufacturer Part Number: CRT0603-BY-1002ELF; Automotive: Yes; Value: 10K 0.1%

## Sheet DDR5_System_Connector.SchDoc
size A4; MPS_Contact: www.monolithicpower.com
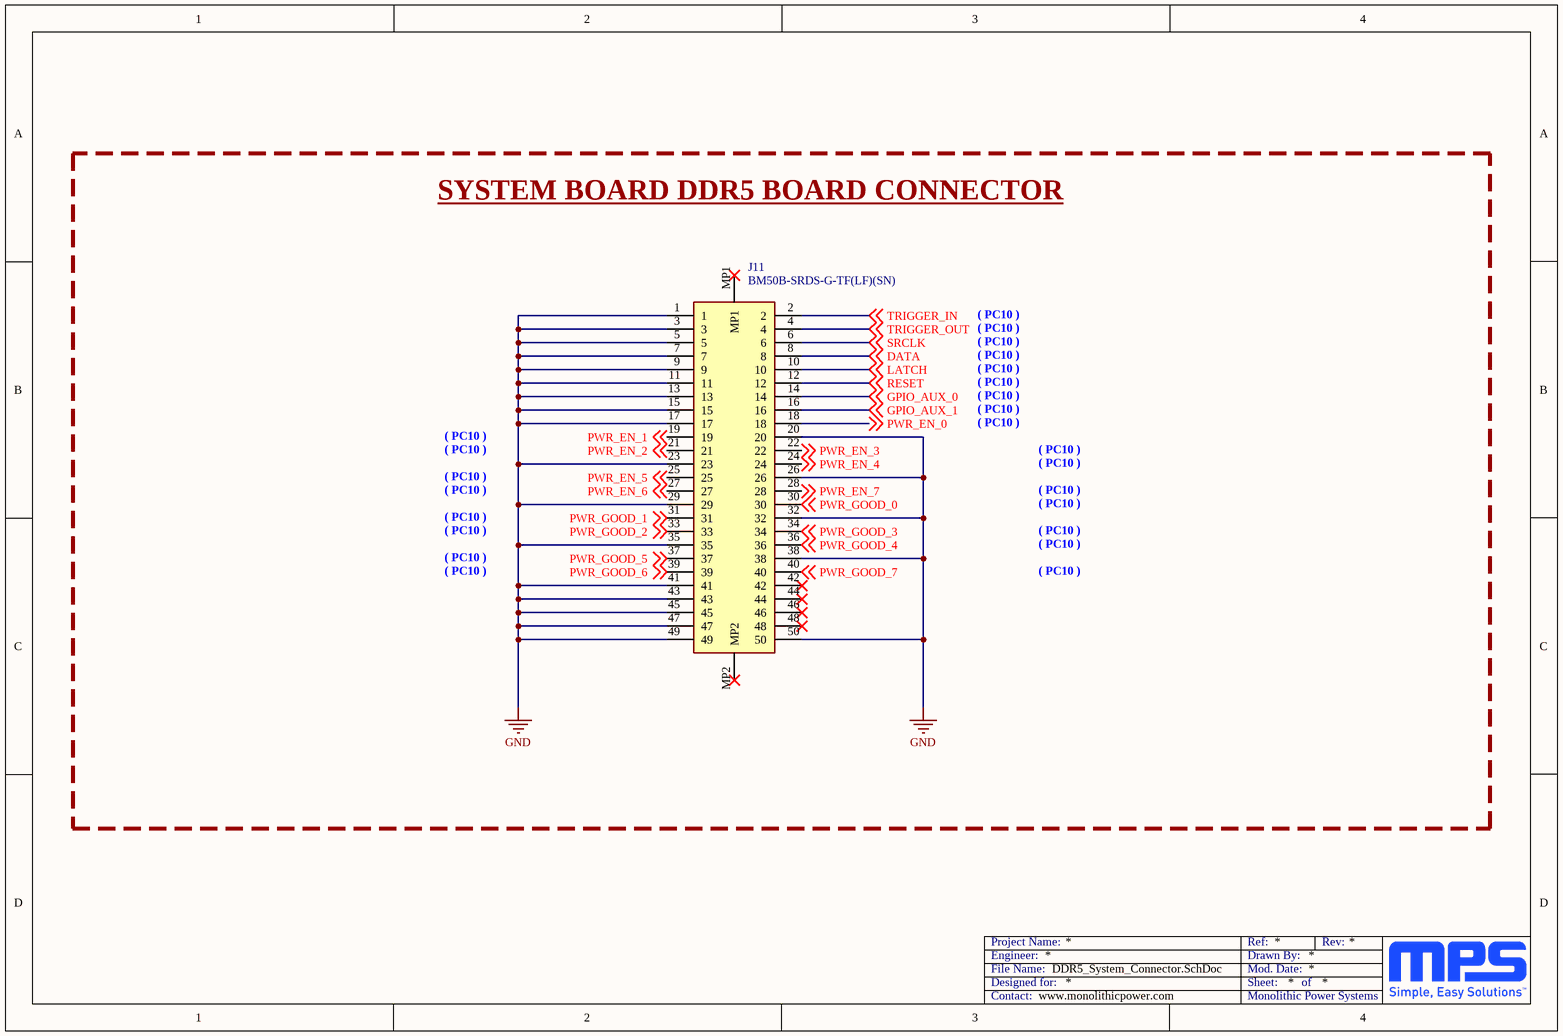
[diagram p6: DDR5_System_Connector.SchDoc]

### Parts
J11  BM50B-SRDS-G-TF(LF)(SN)  [BM50BSRDSGTFLFSN]

### Blocks framed on the sheet
SYSTEM BOARD DDR5 BOARD CONNECTOR: J11

### Nets
GND: J11.1 J11.3 J11.5 J11.7 J11.9 J11.11 J11.13 J11.15 J11.17 J11.20 J11.23 J11.26 J11.29 J11.32 J11.35 J11.38 J11.41 J11.43 J11.45 J11.47 J11.49 J11.50
DATA: J11.8 ; off-sheet DATA
GPIO_AUX_0: J11.14 ; off-sheet GPIO_AUX_0
GPIO_AUX_1: J11.16 ; off-sheet GPIO_AUX_1
LATCH: J11.10 ; off-sheet LATCH
PWR_EN_0: J11.18 ; off-sheet PWR_EN_0
PWR_EN_1: J11.19 ; off-sheet PWR_EN_1
PWR_EN_2: J11.21 ; off-sheet PWR_EN_2
PWR_EN_3: J11.22 ; off-sheet PWR_EN_3
PWR_EN_4: J11.24 ; off-sheet PWR_EN_4
PWR_EN_5: J11.25 ; off-sheet PWR_EN_5
PWR_EN_6: J11.27 ; off-sheet PWR_EN_6
PWR_EN_7: J11.28 ; off-sheet PWR_EN_7
PWR_GOOD_0: J11.30 ; off-sheet PWR_GOOD_0
PWR_GOOD_1: J11.31 ; off-sheet PWR_GOOD_1
PWR_GOOD_2: J11.33 ; off-sheet PWR_GOOD_2
PWR_GOOD_3: J11.34 ; off-sheet PWR_GOOD_3
PWR_GOOD_4: J11.36 ; off-sheet PWR_GOOD_4
PWR_GOOD_5: J11.37 ; off-sheet PWR_GOOD_5
PWR_GOOD_6: J11.39 ; off-sheet PWR_GOOD_6
PWR_GOOD_7: J11.40 ; off-sheet PWR_GOOD_7
RESET: J11.12 ; off-sheet RESET
SRCLK: J11.6 ; off-sheet SRCLK
TRIGGER_IN: J11.2 ; off-sheet TRIGGER_IN
TRIGGER_OUT: J11.4 ; off-sheet TRIGGER_OUT

Not connected (* = marked no-connect by the designer): J11 42* 44* 46* 48* MP1* MP2*

### Notes on the sheet
- ( PC10 )
- Engineer:
- Designed for:
- File Name:
- Project Name:
- Mod. Date:
- Sheet:
- Drawn By:
- Ref:
- of
- Rev:
- Contact:
- Monolithic Power Systems

### Library data of the parts
J11 = BM50B-SRDS-G-TF(LF)(SN): Manufacturer: JST; DrownBy: Xavier Rocher; Datasheet: https://www.farnell.com/datasheets/2085439.pdf?_gl=1*149c80b*_gcl_aw*R0NMLjE3NzI0MzkxNjIuQ2p3S0NBaUFoNVhOQmhBQUVpd0FfQnU4RlZpZGN3SFZkTmhUaGpab0lwT1FoQkFLZGxhWW9IVVdZQjN2WlhqdGU5dFd2US1sQTZFMy14b0NDLUVRQXZEX0J3RQ..*_gcl_au*MjEwMjY0Mzg0MC4xNzcyNDM5MTYx; Package: BM50B Series; Supplier 1: Farnell; Supplier  Part Number 1: 2399332; Supplier 2: Mouser; Supplier  Part Number 2: 306-BM50BSRDSGTFLFSN; Manufacturer Part Number: BM50B-SRDS-G-TF(LF)(SN); Value: BM50B-SRDS-G-TF(LF)(SN)

## Nets that join several sheets
+3V3: I3C_and_I2C_Slaves (R40.2 R42.2 U3.2), Keyboard_Buttons (6 pins), Nucleo_Connector (J1.16)
+5V: Power_Supply (12 pins), I3C_and_I2C_Slaves (5 pins), Nucleo_Connector (J1.18)
+VBUS: I3C_and_I2C_Slaves (J20.2 TP11.1), Nucleo_Connector (R48.2 R49.2)
+VDDIO: Power_Supply (5 pins), I3C_and_I2C_Slaves (J4.3 J6.2 J12.3 J20.3)
+VDDSPD: Power_Supply (5 pins), I3C_and_I2C_Slaves (J4.1 J6.4 J12.1 J20.1)
GND: Power_Supply (16 pins), I3C_and_I2C_Slaves (17 pins), Peripherals (24 pins), Keyboard_Buttons (18 pins), Nucleo_Connector (21 pins), DDR5_System_Connector (22 pins)
CANCEL: Keyboard_Buttons (C6.2 R25.1 R28.2), Nucleo_Connector (J2.4)
DATA: Nucleo_Connector (J2.58), DDR5_System_Connector (J11.8)
DOWN: Keyboard_Buttons (C2.2 R19.1 R21.2), Nucleo_Connector (J1.35)
GPIO_AUX_0: Peripherals (R35.1), Nucleo_Connector (J2.25), DDR5_System_Connector (J11.14)
GPIO_AUX_1: Peripherals (R36.1), Nucleo_Connector (J2.16), DDR5_System_Connector (J11.16)
I2C_SCL: I3C_and_I2C_Slaves (J18.1 R40.1 U3.3), Nucleo_Connector (J2.17)
I2C_SDA: I3C_and_I2C_Slaves (J19.1 R42.1 U3.4), Nucleo_Connector (J1.21)
I3C_HSCL: I3C_and_I2C_Slaves (J5.3), Nucleo_Connector (J15.1)
I3C_HSDA: I3C_and_I2C_Slaves (J5.2), Nucleo_Connector (J16.1)
LATCH: Nucleo_Connector (J1.9), DDR5_System_Connector (J11.10)
LED_STATUS_0: Peripherals (R29.1), Nucleo_Connector (J1.1)
LED_STATUS_1: Peripherals (R30.1), Nucleo_Connector (J1.2)
LED_STATUS_2: Peripherals (R31.1), Nucleo_Connector (J1.3)
LED_STATUS_3: Peripherals (R32.1), Nucleo_Connector (J1.11)
LEFT: Keyboard_Buttons (C3.2 R20.1 R22.2), Nucleo_Connector (J1.37)
OK: Keyboard_Buttons (C5.2 R24.1 R27.2), Nucleo_Connector (J2.6)
PWR_EN_0: Peripherals (R1.1), Nucleo_Connector (J1.57), DDR5_System_Connector (J11.18)
PWR_EN_1: Peripherals (R2.1), Nucleo_Connector (J1.55), DDR5_System_Connector (J11.19)
PWR_EN_2: Peripherals (R3.1), Nucleo_Connector (J1.4), DDR5_System_Connector (J11.21)
PWR_EN_3: Peripherals (R4.1), Nucleo_Connector (J1.40), DDR5_System_Connector (J11.22)
PWR_EN_4: Peripherals (R5.1), Nucleo_Connector (J1.39), DDR5_System_Connector (J11.24)
PWR_EN_5: Peripherals (R6.1), Nucleo_Connector (J1.41), DDR5_System_Connector (J11.25)
PWR_EN_6: Peripherals (R7.1), Nucleo_Connector (J2.19), DDR5_System_Connector (J11.27)
PWR_EN_7: Peripherals (R8.1), Nucleo_Connector (J2.2), DDR5_System_Connector (J11.28)
PWR_GOOD_0: Peripherals (R9.1), Nucleo_Connector (J2.40), DDR5_System_Connector (J11.30)
PWR_GOOD_1: Peripherals (R10.1), Nucleo_Connector (J2.52), DDR5_System_Connector (J11.31)
PWR_GOOD_2: Peripherals (R11.1), Nucleo_Connector (J2.47), DDR5_System_Connector (J11.33)
PWR_GOOD_3: Peripherals (R12.1), Nucleo_Connector (J2.56), DDR5_System_Connector (J11.34)
PWR_GOOD_4: Peripherals (R13.1), Nucleo_Connector (J2.49), DDR5_System_Connector (J11.36)
PWR_GOOD_5: Peripherals (R14.1), Nucleo_Connector (J2.55), DDR5_System_Connector (J11.37)
PWR_GOOD_6: Peripherals (R15.1), Nucleo_Connector (J2.51), DDR5_System_Connector (J11.39)
PWR_GOOD_7: Peripherals (R16.1), Nucleo_Connector (J2.53), DDR5_System_Connector (J11.40)
RESET: Nucleo_Connector (J2.36), DDR5_System_Connector (J11.12)
RIGHT: Keyboard_Buttons (C4.2 R23.1 R26.2), Nucleo_Connector (J2.34)
SRCLK: Nucleo_Connector (J1.52), DDR5_System_Connector (J11.6)
TRIGGER_IN: Peripherals (R33.1), Nucleo_Connector (J2.24), DDR5_System_Connector (J11.2)
TRIGGER_OUT: Peripherals (R34.1), Nucleo_Connector (J2.22), DDR5_System_Connector (J11.4)
UP: Keyboard_Buttons (C1.2 R17.1 R18.2), Nucleo_Connector (J1.38)
VDDIO2: I3C_and_I2C_Slaves (J12.2 TP5.1), Nucleo_Connector (J1.10)